# EasyEDA Pro project ProProject_STC8H小车18650版本_2024-07-14.epro

# Schematic Schematic6
Create Date: 2023-07-03; Page Name: P1; Project Name: STC8H小车18650版本; Schematic Name: Schematic6; Update Date: 2023-07-03; Company: 嘉立创EDA; Page Size: A3; Version: V1.0
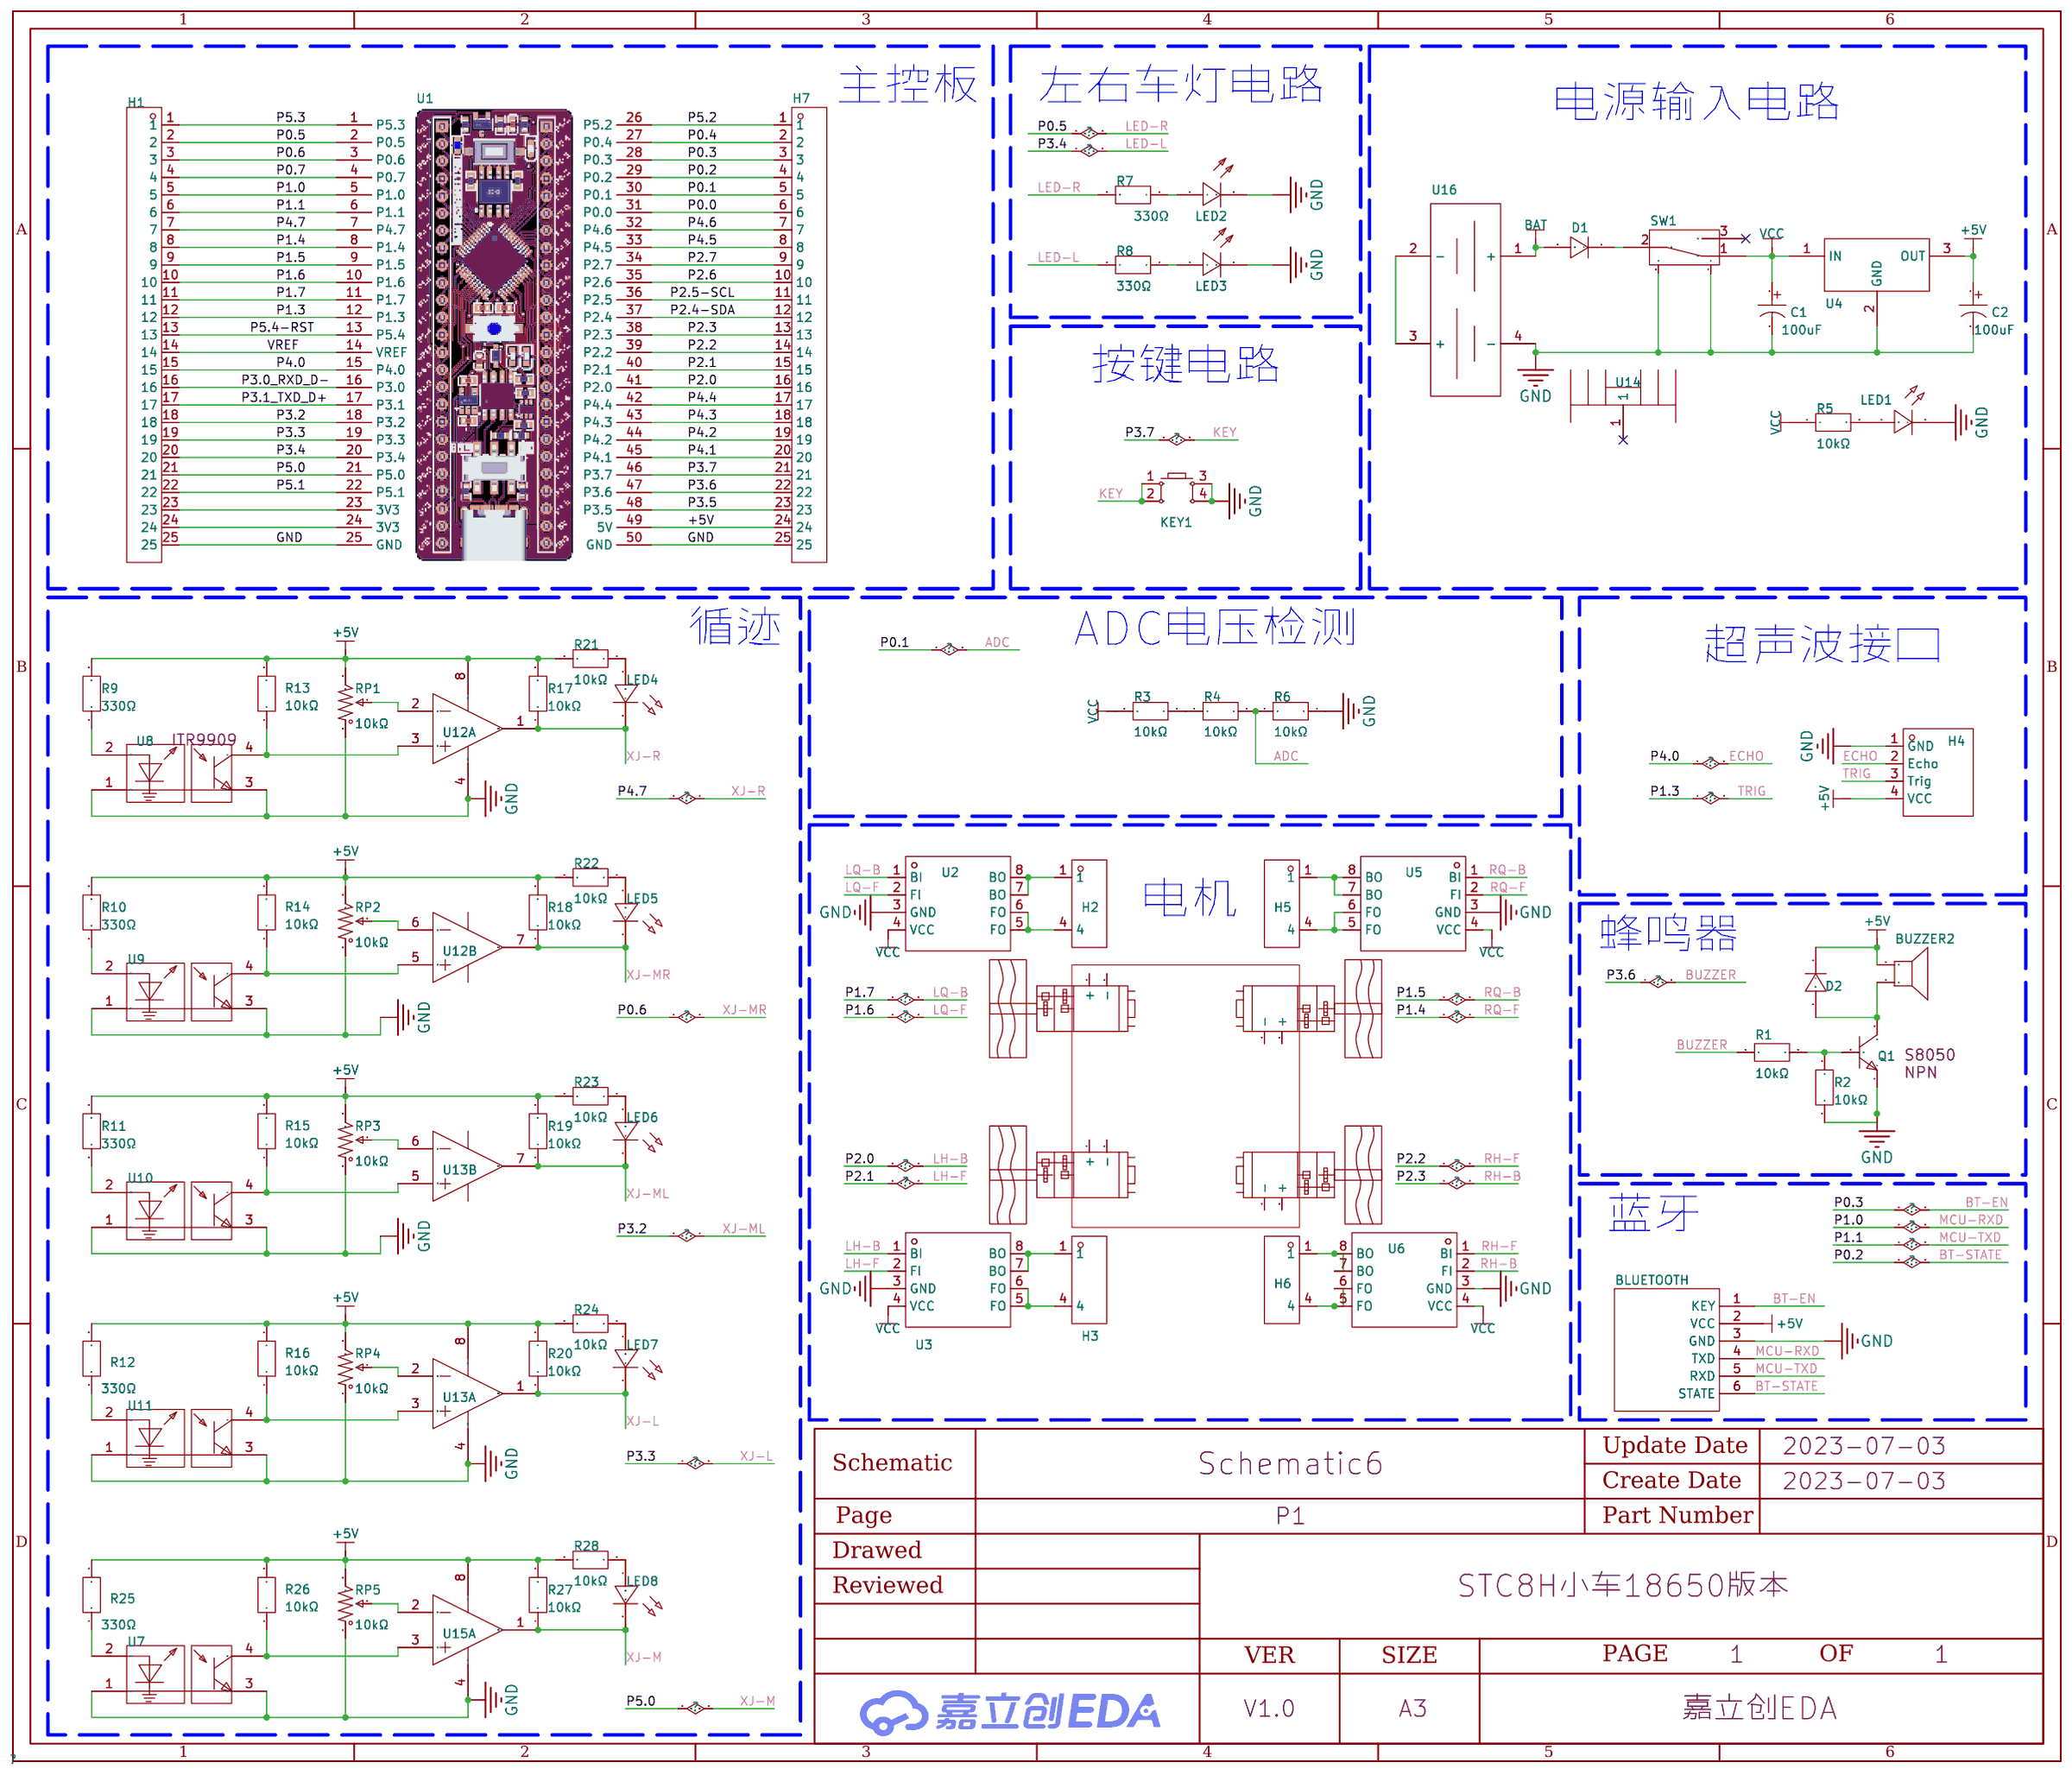
[diagram p0: schematic sheet]

## Parts
ASS_1  直流电机N20  [直流电机N20_水平装配]
ASS_1#2  直流电机N20  [直流电机N20_水平装配]
ASS_1#3  直流电机N20  [直流电机N20_水平装配]
ASS_1#4  直流电机N20  [直流电机N20_水平装配]
BLUETOOTH  JDY-31  [HC-05 PCB]
BUZZER2  4000Hz  [BUZ-TH_BD12.5-P6.50-D0.9]
C1  100uF  [CAP-TH_BD6.3-P2.50-D1.0-FD]
C2  100uF  [CAP-TH_BD6.3-P2.50-D1.0-FD]
D1  -  [DO-41_BD2.4-L4.7-P8.70-D0.9-RD]
D2  -  [DO-41_BD2.4-L4.7-P8.70-D0.9-RD]
H1  -  [HDR-TH_25P-P2.54-V-M]
H2  -  [HDR-TH_4P-P2.54-V-M]
H3  -  [HDR-TH_4P-P2.54-V-M]
H4  超声波测距模块_HC-HR04  [HC-HR04]
H5  -  [HDR-TH_4P-P2.54-V-M]
H6  -  [HDR-TH_4P-P2.54-V-M]
H7  -  [HDR-TH_25P-P2.54-V-M]
KEY1  -  [KEY-TH_4P-L6.0-W6.0-P3.90-LS6.5]
LED1  -  [LED-TH_BD3.0-P2.54-FD]
LED2  -  [LED-TH_BD5.8-P2.54-FD]
LED3  -  [LED-TH_BD5.8-P2.54-FD]
LED4  -  [LED-TH_BD3.0-P2.54-FD]
LED5  -  [LED-TH_BD3.0-P2.54-FD]
LED6  -  [LED-TH_BD3.0-P2.54-FD]
LED7  -  [LED-TH_BD3.0-P2.54-FD]
LED8  -  [LED-TH_BD3.0-P2.54-FD]
Q1  -  [TO-92-3_L5.1-W4.1-P1.27-L]
R1  10kΩ  [RES-TH_BD2.4-L6.3-P10.30-D0.6]
R2  10kΩ  [RES-TH_BD2.4-L6.3-P10.30-D0.6]
R3  10kΩ  [RES-TH_BD2.4-L6.3-P10.30-D0.6]
R4  10kΩ  [RES-TH_BD2.4-L6.3-P10.30-D0.6]
R5  10kΩ  [RES-TH_BD2.4-L6.3-P10.30-D0.6]
R6  10kΩ  [RES-TH_BD2.4-L6.3-P10.30-D0.6]
R7  330Ω  [RES-TH_BD2.3-L6.5-P10.50-D0.5]
R8  330Ω  [RES-TH_BD2.3-L6.5-P10.50-D0.5]
R9  330Ω  [RES-TH_BD2.3-L6.5-P10.50-D0.5]
R10  330Ω  [RES-TH_BD2.3-L6.5-P10.50-D0.5]
R11  330Ω  [RES-TH_BD2.3-L6.5-P10.50-D0.5]
R12  330Ω  [RES-TH_BD2.3-L6.5-P10.50-D0.5]
R13  10kΩ  [RES-TH_BD2.4-L6.3-P10.30-D0.6]
R14  10kΩ  [RES-TH_BD2.4-L6.3-P10.30-D0.6]
R15  10kΩ  [RES-TH_BD2.4-L6.3-P10.30-D0.6]
R16  10kΩ  [RES-TH_BD2.4-L6.3-P10.30-D0.6]
R17  10kΩ  [RES-TH_BD2.4-L6.3-P10.30-D0.6]
R18  10kΩ  [RES-TH_BD2.4-L6.3-P10.30-D0.6]
R19  10kΩ  [RES-TH_BD2.4-L6.3-P10.30-D0.6]
R20  10kΩ  [RES-TH_BD2.4-L6.3-P10.30-D0.6]
R21  10kΩ  [RES-TH_BD2.4-L6.3-P10.30-D0.6]
R22  10kΩ  [RES-TH_BD2.4-L6.3-P10.30-D0.6]
R23  10kΩ  [RES-TH_BD2.4-L6.3-P10.30-D0.6]
R24  10kΩ  [RES-TH_BD2.4-L6.3-P10.30-D0.6]
R25  330Ω  [RES-TH_BD2.3-L6.5-P10.50-D0.5]
R26  10kΩ  [RES-TH_BD2.4-L6.3-P10.30-D0.6]
R27  10kΩ  [RES-TH_BD2.4-L6.3-P10.30-D0.6]
R28  10kΩ  [RES-TH_BD2.4-L6.3-P10.30-D0.6]
RP1  10kΩ  [RES-ADJ-TH_3P-L10.0-W10.0-P2.50-L]
RP2  10kΩ  [RES-ADJ-TH_3P-L10.0-W10.0-P2.50-L]
RP3  10kΩ  [RES-ADJ-TH_3P-L10.0-W10.0-P2.50-L]
RP4  10kΩ  [RES-ADJ-TH_3P-L10.0-W10.0-P2.50-L]
RP5  10kΩ  [RES-ADJ-TH_3P-L10.0-W10.0-P2.50-L]
SW1  -  [SW-TH_SK-12E12-G5]
U1  -  [STC8H8K64U_CORE]
U2  -  [SOP-8_L4.9-W3.9-P1.27-LS6.0-BL]
U3  -  [SOP-8_L4.9-W3.9-P1.27-LS6.0-BL]
U4  -  [TO-220-3_L10.0-W4.5-P2.54-L]
U5  -  [SOP-8_L4.9-W3.9-P1.27-LS6.0-BL]
U6  -  [SOP-8_L4.9-W3.9-P1.27-LS6.0-BL]
U7  -  [OPTO-TH_ITR9909]
U8  -  [OPTO-TH_ITR9909]
U9  -  [OPTO-TH_ITR9909]
U10  -  [OPTO-TH_ITR9909]
U11  -  [OPTO-TH_ITR9909]
U12  -  [DIP-8_L9.7-W6.4-P2.54-LS7.6-BL]  (sections 1,2)
U13  -  [DIP-8_L9.7-W6.4-P2.54-LS7.6-BL]  (sections 1,2)
U14  -  [HEATSINK-TH_L15.5-W10.5-XSD1226-005]
U15  -  [DIP-8_L9.7-W6.4-P2.54-LS7.6-BL]  (section 1)
U16  -  [18650电池盒两节串联]

## Library data of the parts
ASS_1 ASS_1#2-ASS_1#4 = 直流电机N20: Pin Type: IN
BLUETOOTH = HC-05: Pin Type: IN
BUZZER2 = SFN-12055PA6.5: 驱动方式:无源(外部驱动);构造类型:压电式;额定电压:5V;频率:4000Hz;声压(SPL):80dB@5V,10cm;直径(φD):12.5mm;高度:6mm;; LCSC Part Name: 压电无源蜂鸣器; Supplier Part: C360607; Manufacturer: S&S(海旭); Supplier Footprint: 插件,P=6.5mm; JLCPCB Part Class: 扩展库; Datasheet: https://atta.szlcsc.com/upload/public/pdf/source/20220225/D801AF3A55A67CFB490E002F7E7725D1.pdf; Supplier: LCSC; Oscillator Circuit: 无源(外部驱动); Technology Type: 压电式; Rated Voltage: 5V; Sound Pressure Level (SPL): 80dB@5V,10cm; Diameter (φD): 12.5mm; Height: 6mm
C1 C2 = KM107M035E11RR0VH2FP0: 脚间距:2.5mm;纹波电流:168mA 120Hz;容值:100uF;额定电压:35V;等效串联电阻:-;精度:±20%;工作温度:-;电容体长度:11mm;电容体直径:6.3mm;工作寿命:1000hrs 105;; LCSC Part Name: 100uF35V; Supplier Part: C19504; Manufacturer: CX(承兴); Supplier Footprint: 径向引线,6.3x11mm; JLCPCB Part Class: 扩展库; Datasheet: https://atta.szlcsc.com/upload/public/pdf/source/20151029/1457707510876.pdf; Supplier: LCSC; Lead Spacing: 2.5mm; Ripple Current: 168mA120Hz; Rated Voltage: 35V; Tolerance: ±20%; L: 11mm; φD: 6.3mm; Lifetime @ Temp: 1000hrs 105
D1 D2 = 1N4007_C402311: LCSC Part Name: 1N4007; Supplier Part: C402311; Manufacturer: LGE(鲁光); Manufacturer Part: 1N4007; Supplier Footprint: DO-41; Datasheet: https://atta.szlcsc.com/upload/public/pdf/source/20190705/C402311_D2D67FF606A14042155DA6DAFA20C736.pdf; Supplier: LCSC
H1 H7 = X6511WV-25H-C30D60: 间距:2.54mm;总PIN位数:25;排数:1;插针结构:1x25P;行距:-;安装类型:直插;圆针/方针:方针;额定电流:3A;额定电压:250V;配合针长度:6mm;塑高:2.5mm;端接针长度:3mm;触头材质:黄铜;触头镀层:金;工作温度范围:-40℃~+105℃;焊接温度(最大值):260℃;颜色:黑色;; LCSC Part Name: 2.54mm1x25P直插方针高镀金抗氧化; Supplier Part: C725957; Manufacturer: XKBConnectivity(中国星坤); Supplier Footprint: 直插,P=2.54mm; JLCPCB Part Class: 扩展库; Datasheet: https://atta.szlcsc.com/upload/public/pdf/source/20211009/D19569EFFEB9776B42364DF7D41FD96A.pdf; Supplier: LCSC; Pitch: 2.54mm; Number of Pins: 25; Number of Rows: 1; Pin Structure: 1x25P; Mounting Type: 直插; Circluar Pins/Square Pins: 方针; Current Rating (Max): 3A; Voltage Rating (Max): 250V; Length of Mating Pin: 6mm; Insulation Height: 2.5mm; Length of End Connection Pin: 3mm; Contact Material: 黄铜; Contact Plating: 金; Operating Temperature Range: -40℃~+105℃; Welding Temperature (Max): 260℃; Color: 黑色
H2 H3 H5 H6 = HDR-M_2.54_1x4P: Supplier Part: C492403; Supplier Footprint: 插件; NO_CONNECT: yes
H4 = 超声波测距模块_HC-HR04: Pin Type: IN
KEY1 = Key_TH_6x6x4.5: 电路结构:单刀单掷;安装方式:直插;按钮形状:圆形按钮;按钮/盖帽颜色:黑色;作用力:250gf@±30gf;引脚样式:PC引脚;开关长度:6mm;开关宽度:6mm;开关高度:4.5mm;带支架:否;; Supplier Part: C2834896; Supplier Footprint: 插件
LED1 = LED_TH-R_3mm: Supplier Footprint: 插件; Supplier: 立创商城; Supplier Part: C99771
LED2 LED3 = TJ-L5FCMYGTDLSFLC6TW-A5: 发光颜色:白灯;; LCSC Part Name: 白灯; Supplier Part: C331025; Manufacturer: TOGIALED(台湾统佳); Supplier Footprint: 插件,D=5mm; JLCPCB Part Class: 扩展库; Datasheet: https://atta.szlcsc.com/upload/public/pdf/source/20190107/C331025_3C86FA64154A6CCDAF3EF0231B5ACE43.pdf; Supplier: LCSC; Emitted Color: 白灯
LED4-LED6 = LED_TH-G_3mm: Supplier Footprint: 插件; Supplier Part: C330929; Supplier: 立创商城
LED7 LED8 = LED_TH-G_3mm: Supplier Footprint: 插件; Supplier: 立创商城; Supplier Part: C330929
Q1 = S8050: 晶体管类型:NPN;集射极击穿电压(Vceo):25V;集电极电流(Ic):500mA;功率(Pd):625mW;集电极-发射极饱和电压(VCE(sat)@Ic,Ib):600mV@500mA,50mA;直流电流增益(hFE@Ic,Vce):85@50A,1V;特征频率(fT):150MHz;工作温度:+150@(Tj);; LCSC Part Name: S8050TO-92TO-92; Supplier Part: C2826359; Manufacturer: Slkor(萨科微); Supplier Footprint: TO-92; JLCPCB Part Class: 扩展库; Datasheet: https://atta.szlcsc.com/upload/public/pdf/source/20210420/C2826359_B8820C49D6B6820579F5C2002741ABDD.pdf; Supplier: LCSC; Transistor Type: NPN; Collector-Emitter Breakdown Voltage (Vceo): 25V; Collector Current (Ic): 500mA; Power Dissipation (Pd): 625mW; Collector-Emitter Saturation Voltage (VCE(sat)@Ic,Ib): 600mV@500mA,50mA; DC Current Gain (hFE@Ic,Vce): 85@50A,1V; Transition Frequency (fT): 150MHz; Operating Temperature: +150@(Tj)
R1-R6 R13-R24 R26-R28 = RN 1/4W 10K F T/B A1: 电阻类型:金属膜电阻;阻值:10kΩ;精度:±1%;功率:250mW;温度系数:±50ppm/;最大工作电压:250V;工作温度范围:-55~+125;; LCSC Part Name: 10kΩ±1%250mW; Supplier Part: C410695; Manufacturer: Tyohm(幸亚电阻); Manufacturer Part: RN1/4W10KFT/BA1; Supplier Footprint: 轴向引线; JLCPCB Part Class: 扩展库; Datasheet: https://atta.szlcsc.com/upload/public/pdf/source/20190808/C410695_F4C96186075092C4BC649A77CE7E5B2A.pdf; Supplier: LCSC; Type: 金属膜电阻; Tolerance: ±1%; Power(Watts): 250mW; Temperature Coefficient: ±50ppm/; Overload Voltage (Max): 250V; Operating Temperature Range: -55~+125
R7-R12 R25 = MF1/4W-330Ω±1%T52: 温度系数:±200ppm/;工作温度范围:-;阻值:330Ω;功率:250mW;类型:金属膜电阻;精度:±1%;; LCSC Part Name: 330Ω(3300)±1%; Supplier Part: C713986; Manufacturer: 华星机电; Supplier Footprint: 轴向引线; JLCPCB Part Class: 扩展库; Datasheet: https://atta.szlcsc.com/upload/public/pdf/source/20200731/C713882_AE8EB1102749D7E4FB4FB13DC898C429.pdf; Supplier: LCSC; Temperature Coefficient: ±200ppm/; Power(Watts): 250mW; Type: 金属膜电阻; Tolerance: ±1%
RP1-RP5 = 3296W-1-103: 阻值:10kΩ;精度:±10%;温度系数:±250ppm/;; LCSC Part Name: 10kΩ±10%; Supplier Part: C118954; Manufacturer: BOCHEN(博晨); Supplier Footprint: 插件; JLCPCB Part Class: 扩展库; Datasheet: https://atta.szlcsc.com/upload/public/pdf/source/20171114/C118954_15106326646611117443.pdf; Supplier: LCSC; Tolerance: ±10%; Temperature Coefficient: ±250ppm/
SW1 = SK-12E12-G5: 额定电流(DC):-;额定电压(DC):-;额定电流(AC):-;额定电压(AC):-;电路结构:单刀双掷;安装方式:卧插;机械寿命:5000;滑钮形状:矩形柱状;引脚样式:PC引脚;工作温度:-25~+70;开关高度:10.6mm;; Supplier Part: C136720; Manufacturer: 韩国韩荣; Supplier Footprint: 插件; JLCPCB Part Class: 扩展库; Datasheet: https://atta.szlcsc.com/upload/public/pdf/source/20210810/880D64C2F8CCE477762EFCC00B7B7681.pdf; Supplier: LCSC; Circuit: 单刀双掷; Mounting Style: 卧插; Mechanical Life: 5000; Actuator Style: 矩形柱状; Pin Style: PC引脚; Operating Temperature: -25~+70; Switch Height: 10.6mm
U1 = STC8H8K64U_CORE
U2 U3 U5 U6 = rz7899: 25V 4A 控制直流电机正反转; Supplier Part: C92373; Manufacturer: RZ睿智微; Supplier Footprint: SOP-8_150mil; JLCPCB Part Class: 扩展库; Datasheet: https://atta.szlcsc.com/upload/public/pdf/source/20170213/1486965283321.pdf; Supplier: LCSC
U4 = L7805CV: 输出类型:固定;输出极性:正;输出通道数:1;最大输入电压:35V;输出电压:5V;压差:2V@(1A);输出电流:1.5A;电源纹波抑制比(PRSS):62dB@(120Hz);; LCSC Part Name: Vin=35VVout=5V1.5A62dB@(120Hz)散热片厚度0.6mm; Supplier Part: C111887; Manufacturer: ST(意法半导体); Supplier Footprint: TO-220(TO-220-3); JLCPCB Part Class: 扩展库; Datasheet: https://atta.szlcsc.com/upload/public/pdf/source/20170511/1494500122263.pdf; Supplier: LCSC; Output Type: 固定; Output Polarity: 正; Number of Outputs: 1; Maximum Input Voltage: 35V; Output Voltage: 5V; Dropout Voltage: 2V@(1A); Output Current: 1.5A; Power Supply Rejection Ratio (PRSS): 62dB@(120Hz)
U7-U11 = ITR9909: Supplier Part: C53399; Manufacturer: EVERLIGHT(台湾亿光); Supplier Footprint: DIP-4; JLCPCB Part Class: 扩展库; Datasheet: https://atta.szlcsc.com/upload/public/pdf/source/20201022/C53399_E5C79523D84B21DC4419F8E709CCCF2E.pdf; Supplier: LCSC
U12 U13 U15 = XD393: 比较器组数:-;电源电压:-;各通道供电电流:-;输出类型:-;传播延迟:-;; LCSC Part Name: 模拟比较器; Supplier Part: C561266; Manufacturer: XINLUDA(信路达); Supplier Footprint: DIP-8; JLCPCB Part Class: 扩展库; Datasheet: https://atta.szlcsc.com/upload/public/pdf/source/20220616/E76F986B22492B94D9FEFF1B0F4D78D5.pdf; Supplier: LCSC
U14 = 散热片15.5*10.5*24 带针: LCSC Part Name: 散热片15.5*10.5*24带针H型; Supplier Part: C108928; Manufacturer: XSD(鑫顺达); Manufacturer Part: 散热片15.5*10.5*24带针; Supplier Footprint: 15*10.5*24; JLCPCB Part Class: 扩展库; Datasheet: https://atta.szlcsc.com/upload/public/pdf/source/20180614/C108928_606EC6D8E4D943F4065E73A7656775A1.pdf; Supplier: LCSC
U16 = 18650电池盒两节串联

## Nets
+5V: BLUETOOTH.2(VCC) BUZZER2.1 C2.1 D2.1 H4.4(VCC) H7.24 R9.2 R10.2 R11.2 R12.2 R13.2 R14.2 R15.2 R16.2 R17.2 R18.2 R19.2 R20.2 R21.2 R22.2 R23.2 R24.2 R25.2 R26.2 R27.2 R28.2 RP1.3 RP2.3 RP3.3 RP4.3 RP5.3 U1.49(5V) U4.3(OUT) U12.8(VCC) U13.8(VCC) U15.8(VCC)
GND: BLUETOOTH.3(GND) C1.2 C2.2 H1.25 H4.1(GND) H7.25 KEY1.3 KEY1.4 LED1.2(A) LED2.2 LED3.2 Q1.1(E) R2.1 R6.1 RP1.1 RP2.1 RP3.1 RP4.1 RP5.1 SW1.4 SW1.5 U1.25(GND) U1.50(GND) U2.3(GND) U3.3(GND) U4.2(GND) U5.3(GND) U6.3(GND) U7.1 U7.3 U8.1 U8.3 U9.1 U9.3 U10.1 U10.3 U11.1 U11.3 U12.4(GND) U13.4(GND) U15.4(GND) U16.4(-)
VCC: C1.1 R3.2 R5.1 SW1.1 U2.4(VCC) U3.4(VCC) U4.1(IN) U5.4(VCC) U6.4(VCC)
ADC: H7.5 R4.1 R6.2 U1.30(P0.1)
BAT: D1.2 U16.1(+)
BT-EN: BLUETOOTH.1(KEY) H7.3 U1.28(P0.3)
BT-STATE: BLUETOOTH.6(STATE) H7.4 U1.29(P0.2)
BUZZER: H7.22 R1.1 U1.47(P3.6)
ECHO: H1.15 H4.2(Echo) U1.15(P4.0)
KEY: H7.21 KEY1.1 KEY1.2 U1.46(P3.7)
LED-L: H1.20 R8.2 U1.20(P3.4)
LED-R: H1.2 R7.2 U1.2(P0.5)
LH-B: H7.16 U1.41(P2.0) U3.1(BI)
LH-F: H7.15 U1.40(P2.1) U3.2(FI)
LQ-B: H1.11 U1.11(P1.7) U2.1(BI)
LQ-F: H1.10 U1.10(P1.6) U2.2(FI)
MCU-RXD: BLUETOOTH.4(TXD) H1.5 U1.5(P1.0)
MCU-TXD: BLUETOOTH.5(RXD) H1.6 U1.6(P1.1)
P0.0: H7.6 U1.31(P0.0)
P0.4: H7.2 U1.27(P0.4)
P0.6: H1.3 LED5.2(A) R18.1 U1.3(P0.6) U12.7(OUT2)
P0.7: H1.4 U1.4(P0.7)
P1.3: H1.12 H4.3(Trig) U1.12(P1.3)
P1.4: H1.8 U1.8(P1.4) U5.2(FI)
P1.5: H1.9 U1.9(P1.5) U5.1(BI)
P2.2: H7.14 U1.39(P2.2) U6.1(BI)
P2.3: H7.13 U1.38(P2.3) U6.2(FI)
P2.4-SDA: H7.12 U1.37(P2.4)
P2.5-SCL: H7.11 U1.36(P2.5)
P2.6: H7.10 U1.35(P2.6)
P2.7: H7.9 U1.34(P2.7)
P3.0_RXD_D-: H1.16 U1.16(P3.0)
P3.1_TXD_D+: H1.17 U1.17(P3.1)
P3.2: H1.18 LED6.2(A) R19.1 U1.18(P3.2) U13.7(OUT2)
P3.3: H1.19 LED7.2(A) R20.1 U1.19(P3.3) U13.1(OUT1)
P3.5: H7.23 U1.48(P3.5)
P4.1: H7.20 U1.45(P4.1)
P4.2: H7.19 U1.44(P4.2)
P4.3: H7.18 U1.43(P4.3)
P4.4: H7.17 U1.42(P4.4)
P4.5: H7.8 U1.33(P4.5)
P4.6: H7.7 U1.32(P4.6)
P4.7: H1.7 LED4.2(A) R17.1 U1.7(P4.7) U12.1(OUT1)
P5.0: H1.21 LED8.2(A) R27.1 U1.21(P5.0) U15.1(OUT1)
P5.1: H1.22 U1.22(P5.1)
P5.2: H7.1 U1.26(P5.2)
P5.3: H1.1 U1.1(P5.3)
P5.4-RST: H1.13 U1.13(P5.4)
VREF: H1.14 U1.14(VREF)
$1N5269: D1.1 SW1.2
$1N5272: LED2.1 R7.1
$1N5275: LED3.1 R8.1
$1N5280: RP4.2 U13.2(IN1-)
$1N5281: RP3.2 U13.6(IN2-)
$1N5282: R11.1 U10.2
$1N5283: R9.1 U8.2
$1N5309: R3.1 R4.2
$1N5335: H1.23 U1.23(3V3)
$1N5336: H1.24 U1.24(3V3)
$1N5409: LED4.1(C) R21.1
$1N5410: RP1.2 U12.2(IN1-)
$1N5411: R13.1 U8.4 U12.3(IN1+)
$1N5412: R10.1 U9.2
$1N5413: RP2.2 U12.6(IN2-)
$1N5420: LED6.1(C) R23.1
$1N5422: R14.1 U9.4 U12.5(IN2+)
$1N5423: R15.1 U10.4 U13.5(IN2+)
$1N5424: R12.1 U11.2
$1N5425: R16.1 U11.4 U13.3(IN1+)
$1N5426: LED7.1(C) R24.1
$1N5435: H3.1 U3.7(BO) U3.8(BO)
$1N5436: H3.4 U3.5(FO) U3.6(FO)
$1N5437: H2.1 U2.7(BO) U2.8(BO)
$1N5438: H2.4 U2.5(FO) U2.6(FO)
$1N5440: H5.1 U5.7(BO) U5.8(BO)
$1N5441: H5.4 U5.5(FO) U5.6(FO)
$1N5443: BUZZER2.2 D2.2 Q1.3(C)
$1N5444: Q1.2(B) R1.2 R2.2
$1N5446: H6.1 U6.7(BO) U6.8(BO)
$1N5447: H6.4 U6.5(FO) U6.6(FO)
$1N5452: LED1.1(C) R5.2
$1N12611: U16.2(-) U16.3(+)
$1N13005: RP5.2 U15.2(IN1-)
$1N13006: R25.1 U7.2
$1N13007: R26.1 U7.4 U15.3(IN1+)
$1N13008: LED8.1(C) R28.1
$1N15984: LED5.1(C) R22.1

Not connected (* = marked no-connect by the designer): ASS_1 1(+) 2(-); ASS_1#2 1(+) 2(-); ASS_1#3 1(+) 2(-); ASS_1#4 1(+) 2(-); SW1 3*; U14 1*

## Notes on the sheet
- 主控板
- 左右车灯电路
- 电源输入电路
- 按键电路
- 循迹
- ADC电压检测
- 超声波接口
- 电机
- 蜂鸣器
- 蓝牙

# Board PCB11
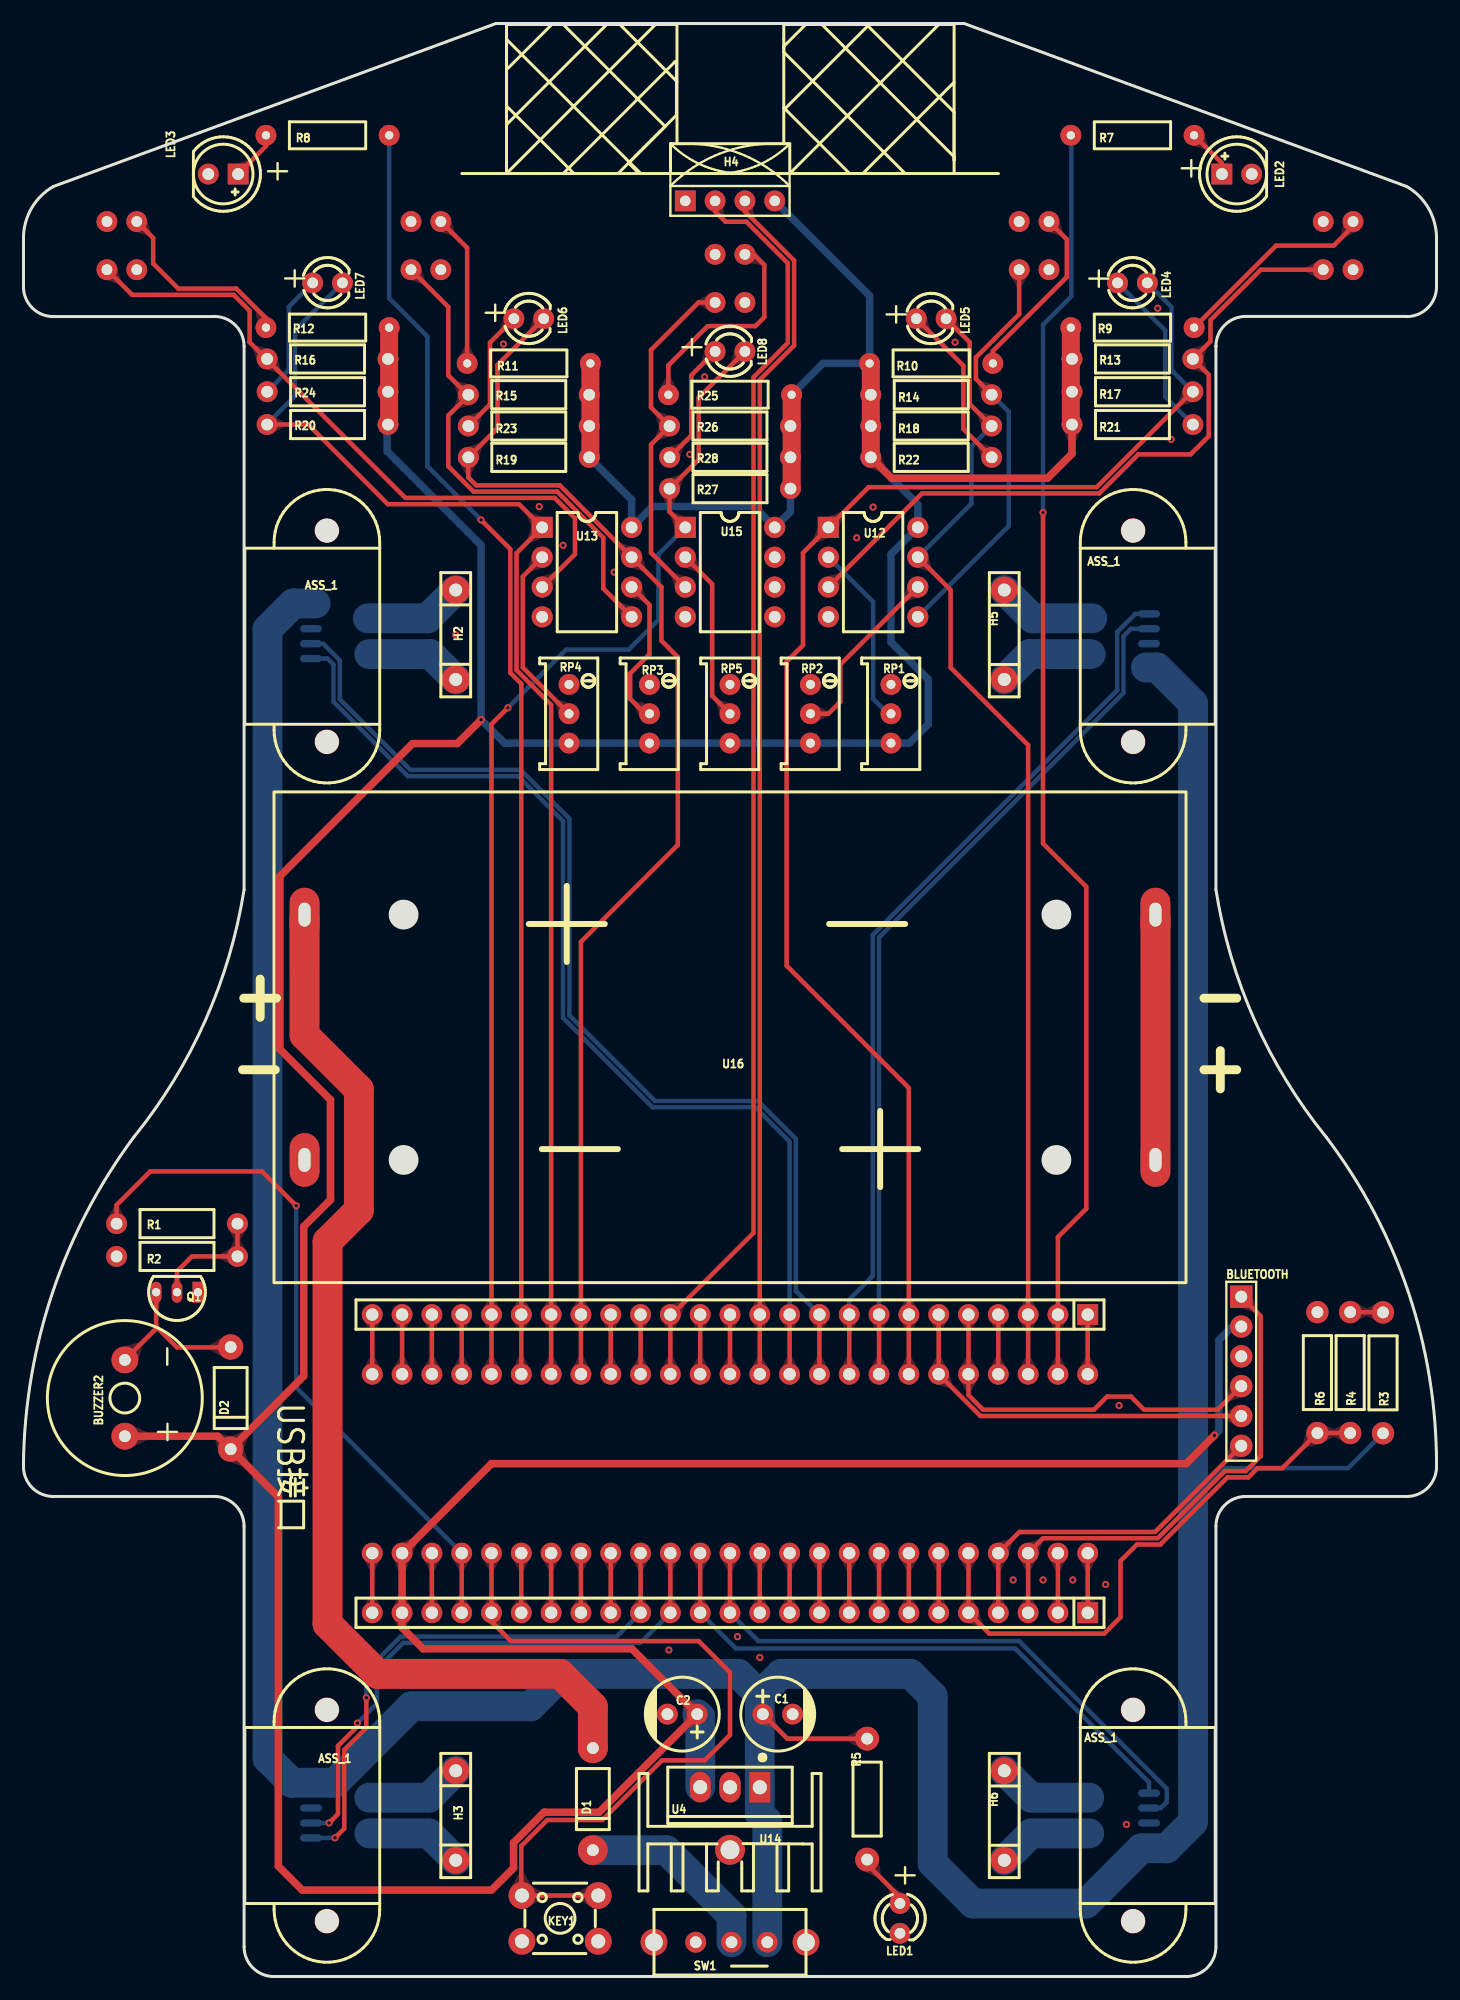
[diagram p1: board, top side]
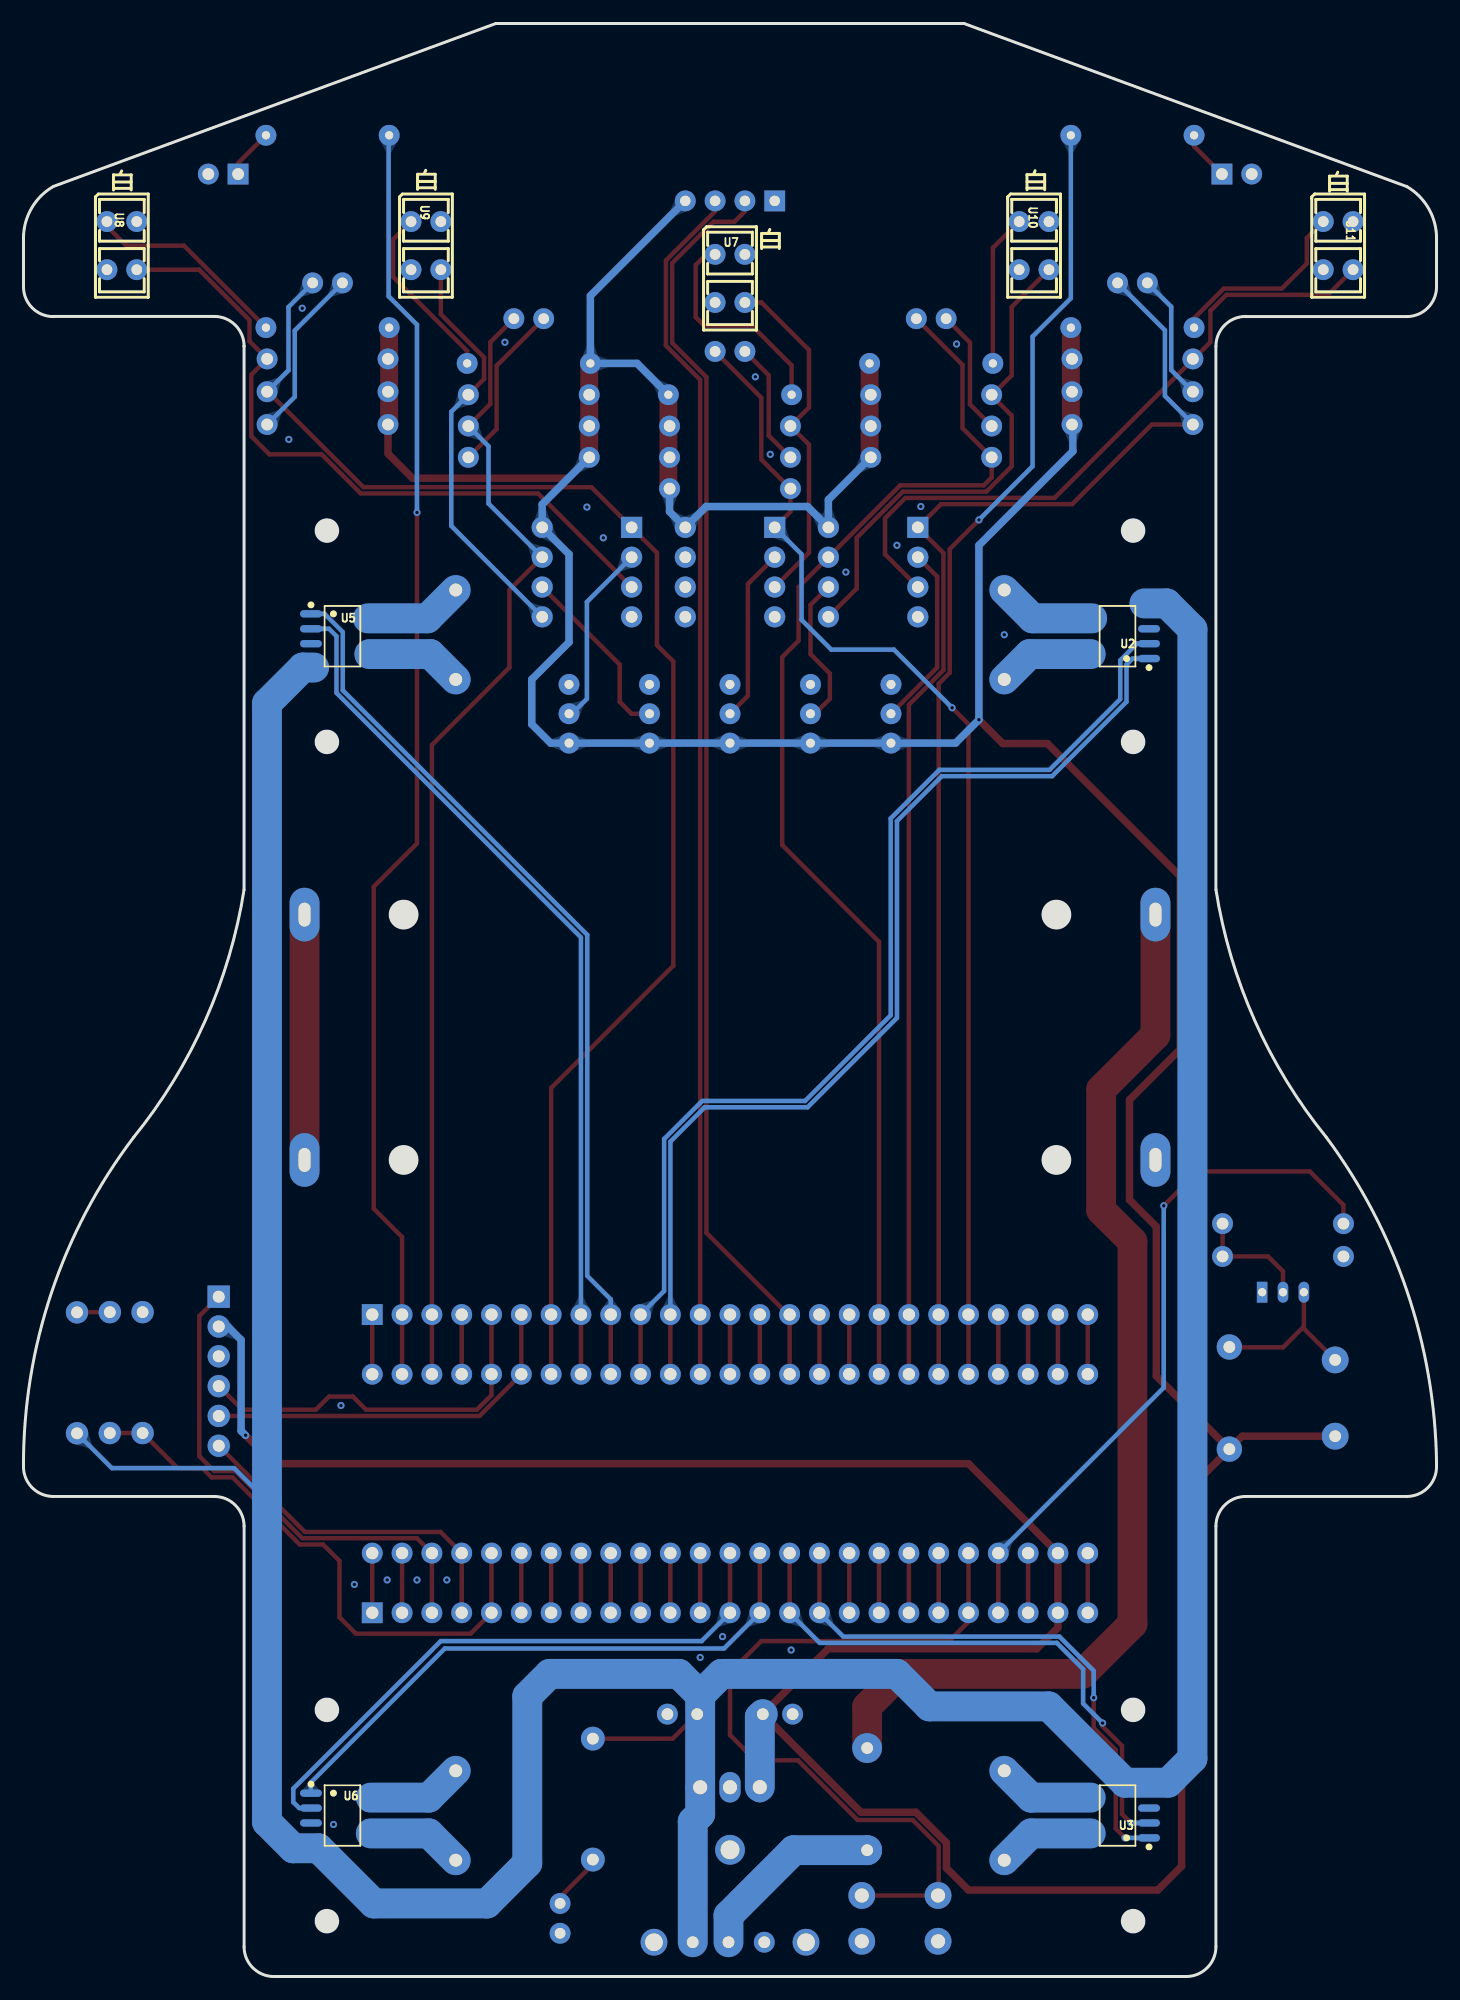
[diagram p2: board, bottom side, seen from below]

Outline 120.4 x 166.37 mm; copper layers: Top Layer, Bottom Layer. Coordinates in mm from the lower left corner of the outline.
Outline path: 0,148.08 0,143.94 arc(0.74,142.15) 2.54,141.4 16.24,141.4 arc(16.25,141.41) 16.26,141.41 arc(18.05,140.67) 18.8,138.87 18.8,92.58 arc(15.48,81.42) 9.4,71.5 arc(2.52,58.4) 0,43.82 0,43.43 arc(0.74,41.64) 2.54,40.89 16.26,40.89 arc(18.05,40.15) 18.8,38.35 18.8,2.54 arc(19.54,0.74) 21.34,0 99.06,0 arc(100.86,0.74) 101.6,2.54 101.6,38.35 arc(102.34,40.15) 104.14,40.89 117.86,40.89 arc(119.65,41.64) 120.4,43.43 arc(118.01,58.24) 111,71.5 arc(104.91,81.42) 101.6,92.58 101.6,138.87 arc(101.6,138.87) 101.6,138.87 arc(102.34,140.67) 104.14,141.41 117.84,141.41 arc(117.85,141.41) 117.86,141.4 arc(119.65,142.15) 120.4,143.94 120.4,148.08 arc(119.72,150.62) 117.86,152.48 80.14,166.37 40.26,166.37 2.54,152.48 arc(0.68,150.62) 0,148.08
Stack: Top Layer 0.035mm / Dielectric1 1.51mm FR4 er 4.5 / Bottom Layer 0.035mm

## Design rules (mm)
template: 用户自定义配置
spacing safeClearance (default): track to track 0.152, other pairs 0.152 to 0.3
track width trackWidth (default): min 0.127, default 0.254, max 2.54
differential pair differentialPair (default): width min 0.127, default 0.254, max 2.54; gap min 0.152, default 0.152
via viaSize (default): diameter min 0.5, default 0.61, max 10; hole min 0.3, default 0.305, max 6

## Placement (name value [footprint] x y rotation side)
ASS_1  直流电机N20  [直流电机N20_水平装配]  30.35 114.17 90 top
ASS_1#2  直流电机N20  [直流电机N20_水平装配]  30.35 13.72 90 top
ASS_1#3  直流电机N20  [直流电机N20_水平装配]  90.04 114.17 270 top
ASS_1#4  直流电机N20  [直流电机N20_水平装配]  90.04 13.72 270 top
BLUETOOTH  JDY-31  [hc-05 pcb]  103.76 57.91 0 top
BUZZER2  4000Hz  [buz-th_bd12.5-p6.50-d0.9]  8.64 49.28 90 top
C1  100uF  [cap-th_bd6.3-p2.50-d1.0-fd]  64.26 22.35 0 top
C2  100uF  [cap-th_bd6.3-p2.50-d1.0-fd]  56.13 22.35 180 top
D1  -  [do-41_bd2.4-l4.7-p8.70-d0.9-rd]  48.51 15.11 90 top
D2  -  [do-41_bd2.4-l4.7-p8.70-d0.9-rd#2]  17.65 49.28 90 top
H1  -  [hdr-th_25p-p2.54-v-m]  60.2 56.39 180 top
H2  -  [hdr-th_4p-p2.54-v-m#2]  36.83 114.3 90 top
H3  -  [hdr-th_4p-p2.54-v-m]  36.83 13.72 90 top
H4  超声波测距模块_HC-HR04  [hc-hr04]  60.2 151.26 0 top
H5  -  [hdr-th_4p-p2.54-v-m]  83.57 114.3 270 top
H6  -  [hdr-th_4p-p2.54-v-m]  83.57 13.72 270 top
H7  -  [hdr-th_25p-p2.54-v-m]  60.2 30.99 180 top
KEY1  -  [key-th_4p-l6.0-w6.0-p3.90-ls6.5]  45.72 4.95 0 top
LED1  -  [led-th_bd3.0-p2.54-fd]  74.68 4.95 270 top
LED2  -  [led-th_bd5.8-p2.54-fd]  103.38 153.54 0 top
LED3  -  [led-th_bd5.8-p2.54-fd]  17.02 153.54 180 top
LED4  -  [led-th_bd3.0-p2.54-fd]  94.49 144.27 0 top
LED5  -  [led-th_bd3.0-p2.54-fd]  77.34 141.22 0 top
LED6  -  [led-th_bd3.0-p2.54-fd]  43.05 141.22 0 top
LED7  -  [led-th_bd3.0-p2.54-fd]  25.91 144.27 0 top
LED8  -  [led-th_bd3.0-p2.54-fd]  60.2 138.43 0 top
Q1  -  [to-92-3_l5.1-w4.1-p1.27-l]  13.08 58.29 180 top
R1  10kΩ  [res-th_bd2.4-l6.3-p10.30-d0.6]  13.08 64.13 0 top
R2  10kΩ  [res-th_bd2.4-l6.3-p10.30-d0.6]  13.08 61.34 0 top
R3  10kΩ  [res-th_bd2.4-l6.3-p10.30-d0.6#2]  115.83 51.42 270 top
R4  10kΩ  [res-th_bd2.4-l6.3-p10.30-d0.6#2]  113.04 51.44 90 top
R5  10kΩ  [res-th_bd2.4-l6.3-p10.30-d0.6#3]  71.88 15.11 270 top
R6  10kΩ  [res-th_bd2.4-l6.3-p10.30-d0.6#2]  110.25 51.44 270 top
R7  330Ω  [res-th_bd2.3-l6.5-p10.50-d0.5]  94.49 156.84 180 top
R8  330Ω  [res-th_bd2.3-l6.5-p10.50-d0.5]  25.91 156.84 0 top
R9  330Ω  [res-th_bd2.3-l6.5-p10.50-d0.5]  94.49 140.46 180 top
R10  330Ω  [res-th_bd2.3-l6.5-p10.50-d0.5]  77.34 137.41 180 top
R11  330Ω  [res-th_bd2.3-l6.5-p10.50-d0.5]  43.05 137.41 0 top
R12  330Ω  [res-th_bd2.3-l6.5-p10.50-d0.5]  25.91 140.46 0 top
R13  10kΩ  [res-th_bd2.4-l6.3-p10.30-d0.6]  94.49 137.79 180 top
R14  10kΩ  [res-th_bd2.4-l6.3-p10.30-d0.6]  77.34 134.75 180 top
R15  10kΩ  [res-th_bd2.4-l6.3-p10.30-d0.6]  43.05 134.75 0 top
R16  10kΩ  [res-th_bd2.4-l6.3-p10.30-d0.6]  25.91 137.79 0 top
R17  10kΩ  [res-th_bd2.4-l6.3-p10.30-d0.6]  94.49 135 180 top
R18  10kΩ  [res-th_bd2.4-l6.3-p10.30-d0.6]  77.34 132.08 180 top
R19  10kΩ  [res-th_bd2.4-l6.3-p10.30-d0.6]  43.05 129.41 0 top
R20  10kΩ  [res-th_bd2.4-l6.3-p10.30-d0.6]  25.91 132.21 0 top
R21  10kΩ  [res-th_bd2.4-l6.3-p10.30-d0.6]  94.49 132.21 180 top
R22  10kΩ  [res-th_bd2.4-l6.3-p10.30-d0.6]  77.34 129.41 180 top
R23  10kΩ  [res-th_bd2.4-l6.3-p10.30-d0.6]  43.05 132.08 0 top
R24  10kΩ  [res-th_bd2.4-l6.3-p10.30-d0.6]  25.91 135 0 top
R25  330Ω  [res-th_bd2.3-l6.5-p10.50-d0.5]  60.2 134.75 0 top
R26  10kΩ  [res-th_bd2.4-l6.3-p10.30-d0.6]  60.2 132.08 0 top
R27  10kΩ  [res-th_bd2.4-l6.3-p10.30-d0.6]  60.2 126.75 0 top
R28  10kΩ  [res-th_bd2.4-l6.3-p10.30-d0.6]  60.2 129.41 0 top
RP1  10kΩ  [res-adj-th_3p-l10.0-w10.0-p2.50-l]  73.91 107.57 270 top
RP2  10kΩ  [res-adj-th_3p-l10.0-w10.0-p2.50-l]  67.06 107.57 270 top
RP3  10kΩ  [res-adj-th_3p-l10.0-w10.0-p2.50-l]  53.34 107.57 270 top
RP4  10kΩ  [res-adj-th_3p-l10.0-w10.0-p2.50-l]  46.48 107.57 270 top
RP5  10kΩ  [res-adj-th_3p-l10.0-w10.0-p2.50-l]  60.2 107.57 270 top
SW1  -  [sw-th_sk-12e12-g5]  60.2 2.92 270 top
U1  -  [stc8h8k64u_core]  60.2 43.69 270 top
U2  -  [SOP-8_L4.9-W3.9-P1.27-LS6.0-BL]  27.18 114.17 90 bottom
U3  -  [SOP-8_L4.9-W3.9-P1.27-LS6.0-BL]  27.18 13.72 90 bottom
U4  -  [TO-220-3_L10.0-W4.5-P2.54-L]  60.2 16.13 180 top
U5  -  [SOP-8_L4.9-W3.9-P1.27-LS6.0-BL]  93.22 114.17 270 bottom
U6  -  [SOP-8_L4.9-W3.9-P1.27-LS6.0-BL]  93.22 13.72 270 bottom
U7  -  [opto-th_itr9909]  60.2 144.65 270 bottom
U8  -  [opto-th_itr9909]  112.01 147.45 270 bottom
U9  -  [opto-th_itr9909]  86.11 147.45 270 bottom
U10  -  [opto-th_itr9909]  34.29 147.45 270 bottom
U11  -  [opto-th_itr9909]  8.38 147.45 270 bottom
U12  -  [DIP-8_L9.7-W6.4-P2.54-LS7.6-BL]  72.39 119.63 270 top
U13  -  [DIP-8_L9.7-W6.4-P2.54-LS7.6-BL]  48.01 119.63 270 top
U14  -  [heatsink-th_l15.5-w10.5-xsd1226-005]  60.2 10.79 180 top
U15  -  [DIP-8_L9.7-W6.4-P2.54-LS7.6-BL]  60.2 119.63 270 top
U16  -  [18650电池盒两节串联]  60.2 80.01 0 top

## Footprints (pads in the part's own frame, mm; a bottom-side part is the same pattern mirrored in y, then rotated)
18650电池盒两节串联
  oval 2.54x4.572 hole 1.016x2.032: 1(-36.25,10.45) 2(36.25,10.45) 3(36.25,-10.45) 4(-36.25,-10.45)
buz-th_bd12.5-p6.50-d0.9
  round 2.286 hole 1: 1(-3.25,0) 2(3.25,0)
cap-th_bd6.3-p2.50-d1.0-fd
  round 1.778 hole 1: 1(-1.27,0) 2(1.27,0)
DIP-8_L9.7-W6.4-P2.54-LS7.6-BL
  rect 1.801x1.801 hole 1.001: 1(-3.81,-3.81)
  round 1.801 hole 1.001: 2(-1.27,-3.81) 3(1.27,-3.81) 4(3.81,-3.81) 5(3.81,3.81) 6(1.27,3.81) 7(-1.27,3.81) 8(-3.81,3.81)
do-41_bd2.4-l4.7-p8.70-d0.9-rd
  round 2.54 hole 1: 1(-4.35,0) 2(4.35,0)
do-41_bd2.4-l4.7-p8.70-d0.9-rd#2
  round 2.159 hole 1: 1(-4.35,0) 2(4.35,0)
hc-05 pcb
  rect 1.905x1.905 hole 1.016: 1(0,0)
  round 1.905 hole 1.016: 2(0,-2.54) 3(0,-5.08) 4(0,-7.62) 5(0,-10.16) 6(0,-12.7)
hc-hr04
  rect 1.778x1.778 hole 0.894x0.889: 1(-3.81,0)
  round 1.778 hole 0.894x0.889: 2(-1.27,0) 3(1.27,0) 4(3.81,0)
hdr-th_4p-p2.54-v-m
  round 2.286 hole 1.1: 1(-3.81,0) 4(3.81,0)
hdr-th_4p-p2.54-v-m#2
  round 2.413 hole 1.1: 1(-3.81,0) 4(3.81,0)
hdr-th_25p-p2.54-v-m
  rect 1.778x1.778 hole 1.049: 1(-30.48,0)
  round 1.778 hole 1.049: 2(-27.94,0) 3(-25.4,0) 4(-22.86,0) 5(-20.32,0) 6(-17.78,0) 7(-15.24,0) 8(-12.7,0) 9(-10.16,0) 10(-7.62,0) 11(-5.08,0) 12(-2.54,0) 13(0,0) 14(2.54,0) 15(5.08,0) 16(7.62,0) 17(10.16,0) 18(12.7,0) 19(15.24,0) 20(17.78,0) 21(20.32,0) 22(22.86,0) 23(25.4,0) 24(27.94,0) 25(30.48,0)
heatsink-th_l15.5-w10.5-xsd1226-005
  round 2.54 hole 1.6: 1(0,0)
key-th_4p-l6.0-w6.0-p3.90-ls6.5
  round 2.286 hole 1.199: 1(-3.248,1.95) 2(3.251,1.95) 3(-3.248,-1.95) 4(3.251,-1.95)
led-th_bd3.0-p2.54-fd
  round 1.778 hole 0.914: 1(-1.27,0) 2(1.27,0)
led-th_bd5.8-p2.54-fd
  rect 1.778x1.778 hole 1: 1(-1.27,0)
  round 1.778 hole 1: 2(1.27,0)
opto-th_itr9909
  round 1.778 hole 0.914: 1(-2.05,1.27) 2(-2.05,-1.27) 3(2.05,-1.27) 4(2.05,1.27)
res-adj-th_3p-l10.0-w10.0-p2.50-l
  round 1.778 hole 0.762: 1(-2.499,0) 2(0,0) 3(2.499,0)
res-th_bd2.3-l6.5-p10.50-d0.5
  round 1.778 hole 0.7: 1(-5.25,0) 2(5.25,0)
res-th_bd2.4-l6.3-p10.30-d0.6
  round 1.778 hole 1: 1(-5.15,0) 2(5.15,0)
res-th_bd2.4-l6.3-p10.30-d0.6#2
  round 1.905 hole 1: 1(-5.15,0) 2(5.15,0)
res-th_bd2.4-l6.3-p10.30-d0.6#3
  round 2.032 hole 1: 1(-5.15,0) 2(5.15,0)
SOP-8_L4.9-W3.9-P1.27-LS6.0-BL
  oval 0.63x1.865 smd: 1(-1.905,-2.683) 2(-0.635,-2.683) 3(0.635,-2.683) 4(1.905,-2.683) 5(1.905,2.683) 6(0.635,2.683) 7(-0.635,2.683) 8(-1.905,2.683)
stc8h8k64u_core
  round 1.778 hole 1.049: 1(-7.62,30.48) 2(-7.62,27.94) 3(-7.62,25.4) 4(-7.62,22.86) 5(-7.62,20.32) 6(-7.62,17.78) 7(-7.62,15.24) 8(-7.62,12.7) 9(-7.62,10.16) 10(-7.62,7.62) 11(-7.62,5.08) 12(-7.62,2.54) 13(-7.62,0) 14(-7.62,-2.54) 15(-7.62,-5.08) 16(-7.62,-7.62) 17(-7.62,-10.16) 18(-7.62,-12.7) 19(-7.62,-15.24) 20(-7.62,-17.78) 21(-7.62,-20.32) 22(-7.62,-22.86) 23(-7.62,-25.4) 24(-7.62,-27.94) 25(-7.62,-30.48) 26(7.62,30.48) 27(7.62,27.94) 28(7.62,25.4) 29(7.62,22.86) 30(7.62,20.32) 31(7.62,17.78) 32(7.62,15.24) 33(7.62,12.7) 34(7.62,10.16) 35(7.62,7.62) 36(7.62,5.08) 37(7.62,2.54) 38(7.62,0) 39(7.62,-2.54) 40(7.62,-5.08) 41(7.62,-7.62) 42(7.62,-10.16) 43(7.62,-12.7) 44(7.62,-15.24) 45(7.62,-17.78) 46(7.62,-20.32) 47(7.62,-22.86) 48(7.62,-25.4) 49(7.62,-27.94) 50(7.62,-30.48)
sw-th_sk-12e12-g5
  round 1.778 hole 1.001: 1(0,3.175) 2(0,0.127) 3(0,-2.921)
  round 2.286 hole 1.501: 4(0,-6.477) 5(0,6.477)
to-92-3_l5.1-w4.1-p1.27-l
  rect 0.899x1.778 hole 0.701: 1(-1.778,0)
  oval 0.899x1.778 hole 0.701: 2(0,0) 3(1.778,0)
TO-220-3_L10.0-W4.5-P2.54-L
  rect 1.801x2.601 hole 1.199: 1(-2.54,0.005)
  oval 1.801x2.601 hole 1.199: 2(0,0.005) 3(2.54,-0.005)
直流电机N20_水平装配
  round 2.1 hole 2.005x2: 1(-9,4.5) 2(9,4.5)
  round 2 hole 2.105x2.1: 3(-8.999,4.501) 4(8.999,4.501)

## Nets
As in the schematic.

Pads without a net: ASS_1 1 2 3 4; ASS_1#2 1 2 3 4; ASS_1#3 1 2 3 4; ASS_1#4 1 2 3 4; SW1 3; U14 1; U15 5 6 7

## Via types
v1: diameter 0.61, hole 0.305, Top Layer to Bottom Layer, 31 vias

## Routing (per net, layer and track width the routed paths; a pad name or vN(x,y) marks a point on that pad's centre or on a via; arc(x,y) is an arc through that point)
+5V: length 499
  Top Layer w0.635: BUZZER2.1 16.55,46.03 D2.1 ; R21.2 89.34,129.72 87.25,127.63 73.97,127.63 R22.2 ; D2.1 23.88,51.15 23.88,63.88 26.16,66.17 26.16,74.68 21.84,78.99 21.84,93.73 33.15,105.03 36.96,105.03 v1(38.99,107.06) ; D2.1 21.72,40.86 21.72,9.4 23.75,7.37 39.88,7.37 41.76,9.25 41.76,11.4 44.36,14 49.05,14 C2.1 51.84,27.91 34.06,27.91 32.26,29.72 H7.24 U1.49 39.88,43.69 99.06,43.69 v1(101.47,46.1)
  Top Layer w1.524: R22.2 R18.2 R14.2 72.19,137.31 R10.2 ; R9.2 89.24,132.31 R21.2 ; R25.2 65.45,126.85 R27.2 ; R19.2 48.3,129.51 R11.2 ; R12.2 31.16,132.31 R20.2
  Bottom Layer w0.635: R20.2 30.99,132.14 30.99,129.92 38.99,121.92 v1(38.99,107.06) 40.98,105.07 RP4.3 RP3.3 RP5.3 RP2.3 RP1.3 75.48,105.07 77.09,106.68 77.09,110.49 73.91,113.66 73.91,121.16 U12.8 76.2,125.41 R22.2 ; R19.2 51.82,125.8 U13.8 53.59,125.22 62.23,125.22 U15.8 65.35,124.78 R27.2 ; BLUETOOTH.2 103,55.37 101.85,54.23 101.85,46.48 v1(101.47,46.1) ; R25.2 68.11,137.41 R10.2 72.09,143.17 H4.4
  Bottom Layer w2.54: U4.3 57.66,22.1 C2.1
GND: length 10.2
  Top Layer w0.381: U1.50 H7.25 ; H1.25 U1.25
  vias: v1(36.83,114.3) v1(40.89,139.06) v1(43.94,125.22) v1(45.97,121.92) v1(50.33,119.63) v1(54.99,27.81) v1(56.77,129.67) v1(58.04,136.27) v1(60.83,28.96) v1(62.74,27.18) v1(70.99,122.55) v1(72.39,125.17) v1(79.38,139.22) v1(84.32,33.78) v1(86.87,33.78) v1(89.41,33.78) v1(92.2,33.4) v1(93.34,48.64) v1(93.98,12.95) v1(96.65,142.11) v1(97.79,130.94)
VCC: length 355.8
  Top Layer w0.381: R5.1 65.08,20.26 C1.1
  Bottom Layer w0.381: R3.2 112.87,43.31 102.45,43.31 99.65,40.51
  Bottom Layer w2.54: 62.74,23.97 60.92,25.78 45.97,25.78 43.2,23.01 33.04,23.01 26.54,16.51 22.86,16.51 20.8,18.57 20.8,114.78 22.99,116.97 24.89,116.97 ; 62.74,23.97 64.55,25.78 75.56,25.78 77.47,23.88 77.47,9.65 80.9,6.22 90.55,6.22 95.25,10.92 97.41,10.92 99.65,13.16 99.65,108.46 96.6,111.51 95.63,111.51 ; 62.74,23.97 U4.1 62.74,13.84 63.37,13.21 SW1.1
ADC: length 48.2
  Top Layer w0.381: R4.1 R6.2 107.26,43.31 105.15,43.31 104.36,42.52 102.58,42.52 96.86,36.8 94.87,36.8 93.47,35.41 93.47,30.61 92.08,29.21 82.3,29.21 H7.5 U1.30
BAT: length 92.3
  Top Layer w2.54: 23.95,90.29 23.95,80.19 28.57,75.56 28.57,65.28 25.91,62.61 25.91,30.04 30.17,25.78 45.72,25.78 48.51,22.99 D1.2
BT-EN: length 42.6
  Top Layer w0.381: BLUETOOTH.1 105.41,56.26 105.41,44.32 104.14,43.05 102.35,43.05 96.64,37.34 86.87,37.34 U1.28 H7.3
BT-STATE: length 29.6
  Top Layer w0.381: BLUETOOTH.6 96.42,37.87 84.86,37.87 U1.29 H7.4
BUZZER: length 59.8
  Top Layer w0.381: R1.1 7.93,65.72 10.79,68.58 20.32,68.58 v1(23.24,65.66) ; U1.47 H7.22
  Bottom Layer w0.381: U1.47 23.24,50.16 v1(23.24,65.66)
ECHO: length 107.8
  Top Layer w0.381: H4.2 58.93,150.37 59.82,149.48 61.6,149.48 65.13,145.96 65.13,139.16 62.2,136.24 62.2,63.35 55.24,56.39 H1.15 U1.15
KEY: length 65.7
  Top Layer w0.381: KEY1.2 KEY1.1 42.42,6.96 42.42,11.12 44.63,13.33 49.32,13.33 54.4,18.41 58.04,18.41 60.2,20.57 60.2,25.91 57.53,28.57 41.53,28.57 39.88,30.23 H7.21 U1.46
LED-L: length 110.2
  Top Layer w0.381: v1(38.99,124.08) 41.48,121.59 41.48,111.06 42.42,110.12 H1.20 U1.20
  Bottom Layer w0.381: R8.2 31.16,142.96 34.42,139.7 34.42,128.65 v1(38.99,124.08)
LED-R: length 109.1
  Top Layer w0.381: v1(86.87,124.71) 86.87,96.52 90.55,92.84 90.55,65.4 88.14,62.99 H1.2 U1.2
  Bottom Layer w0.381: v1(86.87,124.71) 86.87,140.72 89.28,143.13 89.28,156.8 R7.2
LH-B: length 47.9
  Top Layer w0.381: v1(26.54,11.81) 27.33,12.6 27.33,19.3 29.21,21.18 v1(29.21,23.75) ; U1.41 H7.16
  Bottom Layer w0.381: v1(26.54,11.81) U3.1 ; v1(29.21,23.75) 29.21,26.03 32.13,28.96 50.55,28.96 H7.16
LH-F: length 48.4
  Top Layer w0.381: v1(26.03,13.08) 26.8,13.84 26.8,19.65 28.45,21.3 v1(28.45,21.59) ; U1.40 H7.15
  Bottom Layer w0.381: H7.15 52.55,28.42 32.35,28.42 30.11,26.18 30.11,23.25 v1(28.45,21.59) ; v1(26.03,13.08) U3.2
LQ-B: length 89.3
  Top Layer w0.381: H1.11 U1.11
  Bottom Layer w0.381: U2.1 25.91,112.27 26.42,111.76 26.42,108.58 32.75,102.25 42.14,102.25 45.97,98.42 45.97,81.66 53.59,74.05 62.35,74.05 65.28,71.12 H1.11
LQ-F: length 91.4
  Top Layer w0.381: H1.10 U1.10
  Bottom Layer w0.381: H1.10 65.81,58.39 65.81,71.34 62.57,74.58 53.81,74.58 46.51,81.88 46.51,98.65 42.37,102.79 32.97,102.79 26.95,108.81 26.95,112.12 25.53,113.54 U2.2
MCU-RXD: length 32.4
  Top Layer w0.381: 103.76,50.29 101.75,48.29 95.48,48.29 94.36,49.4 92.33,49.4 91.21,48.29 81.75,48.29 80.52,49.52 U1.5 H1.5
MCU-TXD: length 32.3
  Top Layer w0.381: BLUETOOTH.5 81.53,47.75 U1.6 H1.6
P0.0: length 5.1
  Top Layer w0.381: U1.31 H7.6
P0.4: length 5.1
  Top Layer w0.381: U1.27 H7.2
P0.6: length 98
  Top Layer w0.381: LED5.2 80.62,139.22 80.62,133.95 R18.1 ; 76.2,120.9 78.99,118.11 78.99,111.51 85.6,104.9 H1.3 U1.3
  Bottom Layer w0.381: 76.2,120.9 80.77,125.48 80.77,130.36 R18.1
P0.7: length 5.1
  Top Layer w0.381: H1.4 U1.4
P1.3: length 102.9
  Top Layer w0.381: U1.12 H1.12 62.74,136.02 65.66,138.94 65.66,146.18 61.47,150.37 H4.3
P1.4: length 73.9
  Top Layer w0.381: H1.8 U1.8
  Bottom Layer w0.381: U5.2 94.36,114.81 93.73,114.17 93.73,109.35 72.9,88.52 H1.8
P1.5: length 76
  Top Layer w0.381: H1.9 U1.9
  Bottom Layer w0.381: U5.1 94.74,116.08 93.19,114.53 93.19,109.57 72.36,88.74 72.36,59.69 70.36,57.68 H1.9
P2.2: length 50.2
  Top Layer w0.381: U1.39 H7.14
  Bottom Layer w0.381: H7.14 60.71,27.94 84.5,27.94 95.9,16.54 U6.1
P2.3: length 51.4
  Top Layer w0.381: U1.38 H7.13
  Bottom Layer w0.381: U6.2 96.9,14.35 97.41,14.86 97.41,16 84.84,28.57 62.61,28.57 H7.13
P2.4-SDA: length 5.1
  Top Layer w0.381: U1.37 H7.12
P2.5-SCL: length 5.1
  Top Layer w0.381: U1.36 H7.11
P2.6: length 5.1
  Top Layer w0.381: U1.35 H7.10
P2.7: length 5.1
  Top Layer w0.381: U1.34 H7.9
P3.0_RXD_D-: length 5.1
  Top Layer w0.381: H1.16 U1.16
P3.1_TXD_D+: length 5.1
  Top Layer w0.381: H1.17 U1.17
P3.2: length 107.6
  Top Layer w0.381: LED6.2 40.39,137.29 40.39,131.9 R19.1 37.9,127.7 38.58,127.03 45.69,127.03 54.36,118.36 54.36,113.79 55.75,112.39 55.75,96.39 47.5,88.14 H1.18 U1.18
P3.3: length 116.1
  Top Layer w0.381: U1.19 H1.19 44.96,108.34 42.01,111.28 42.01,121.26 U13.1 42.21,125.42 31.04,125.42 24.26,132.21 R20.1
  Bottom Layer w0.381: R20.1 20.76,132.26 23.14,134.65 23.14,140.23 LED7.2
P3.5: length 5.1
  Top Layer w0.381: U1.48 H7.23
P4.1: length 5.1
  Top Layer w0.381: U1.45 H7.20
P4.2: length 5.1
  Top Layer w0.381: U1.44 H7.19
P4.3: length 5.1
  Top Layer w0.381: U1.43 H7.18
P4.4: length 5.1
  Top Layer w0.381: U1.42 H7.17
P4.5: length 5.1
  Top Layer w0.381: U1.33 H7.8
P4.6: length 5.1
  Top Layer w0.381: U1.32 H7.7
P4.7: length 124.6
  Top Layer w0.381: U1.7 H1.7 75.44,75.69 65.02,86.11 65.02,112.01 66.42,113.41 66.42,121.28 U12.1 72.01,126.87 91.44,126.87 99.57,135 R17.1
  Bottom Layer w0.381: R17.1 97.82,136.82 97.82,142.21 LED4.2
P5.0: length 100.3
  Top Layer w0.381: U15.1 55.05,124.78 R27.1 57.53,129.23 57.53,134.49 LED8.2 ; U1.21 H1.21 39.88,106.68 v1(41.27,108.08)
  Bottom Layer w0.381: v1(41.27,108.08) 46.23,113.03 51.56,113.03 54.1,115.57 54.1,121.16 U15.1
P5.1: length 5.1
  Top Layer w0.381: H1.22 U1.22
P5.2: length 5.1
  Top Layer w0.381: U1.26 H7.1
P5.3: length 5.1
  Top Layer w0.381: H1.1 U1.1
P5.4-RST: length 5.1
  Top Layer w0.381: H1.13 U1.13
VREF: length 5.1
  Top Layer w0.381: H1.14 U1.14
$1N5269: length 16.4
  Bottom Layer w2.54: D1.1 54.77,10.76 60.33,5.21 SW1.2
$1N5272: length 4.3
  Top Layer w0.381: LED2.1 102.11,154.47 R7.1
$1N5275: length 4.3
  Top Layer w0.381: R8.1 20.66,155.91 LED3.1
$1N5280: length 15.6
  Top Layer w0.381: 44.2,120.9 42.55,119.25 42.55,111.51 RP4.2
$1N5281: length 13
  Top Layer w0.381: RP3.2 52.96,107.57 51.69,108.84 51.69,111 53.34,112.65 53.34,116.84 U13.6
$1N5282: length 13
  Top Layer w0.381: U10.2 37.8,147.25 R11.1
$1N5283: length 17.5
  Top Layer w0.381: U8.2 113.28,149.1 111.63,147.45 106.72,147.45 R9.1
$1N5309: length 2.8
  Top Layer w0.381: R4.2 115.81,56.59 R3.1
$1N5335: length 5.1
  Top Layer w0.381: H1.23 U1.23
$1N5336: length 5.1
  Top Layer w0.381: H1.24 U1.24
$1N5409: length 14.7
  Bottom Layer w0.381: R21.1 97.28,134.56 97.28,140.21 LED4.1
$1N5410: length 15.7
  Bottom Layer w0.381: 68.58,120.9 72.39,117.09 72.39,108.84 73.66,107.57 RP1.2
$1N5411: length 60.2
  Top Layer w0.381: U8.4 105.43,145.4 101.14,141.11 101.14,139.3 R13.1 100.98,136.45 100.98,131.21 99.44,129.67 94.99,129.67 91.66,126.34 76.56,126.34 U12.3
$1N5412: length 15.3
  Top Layer w0.381: R10.1 82.59,138.47 88.9,144.78 88.9,147.97 U9.2
$1N5413: length 15.5
  Top Layer w0.381: U12.6 69.6,111.76 69.6,108.58 68.58,107.57 RP2.2
$1N5420: length 10.8
  Top Layer w0.381: LED6.1 39.75,139.19 39.75,133.93 R23.1
$1N5422: length 35.5
  Top Layer w0.381: U9.4 84.84,141.6 81.15,137.92 81.15,136.09 R14.1
  Bottom Layer w0.381: 76.2,115.82 83.95,123.57 83.95,133.29 R14.1
$1N5423: length 43
  Top Layer w0.381: U10.4 36.19,142.22 36.19,136.4 37.85,134.75 R15.1 37.9,134.68 36.19,132.97 36.19,128.65 38.35,126.49 45.47,126.49 49.4,122.56 49.4,118.24 51.82,115.82
$1N5424: length 16.5
  Top Layer w0.381: U11.2 11.05,148.1 11.05,145.92 13.18,143.79 18.13,143.79 20.66,141.26 R12.1
$1N5425: length 57.3
  Top Layer w0.381: U11.4 9.25,143.26 17.91,143.26 19.27,141.9 19.27,139.22 20.69,137.79 R16.1 20.76,137.74 32.54,125.96 45.25,125.96 46.99,124.22 46.99,121.16 U13.3
$1N5426: length 10.9
  Bottom Layer w0.381: LED7.1 22.61,142.24 22.61,136.85 R24.1
$1N5435: length 8.3
  Bottom Layer w2.54: H3.1 34.54,12.19 29.46,12.19
$1N5436: length 8.3
  Bottom Layer w2.54: H3.4 34.54,15.24 29.46,15.24
$1N5437: length 8.3
  Bottom Layer w2.54: H2.1 34.67,112.65 29.46,112.65
$1N5438: length 8.5
  Bottom Layer w2.54: 36.83,118.11 34.42,115.7 29.34,115.7
$1N5440: length 8.5
  Bottom Layer w2.54: 83.57,118.11 85.98,115.7 91.06,115.7
$1N5441: length 8.3
  Bottom Layer w2.54: H5.4 85.72,112.65 90.93,112.65
$1N5443: length 14
  Top Layer w0.381: BUZZER2.2 11.3,55.19 11.3,55.37 ; Q1.3 11.3,55.37 ; 11.3,55.37 13.08,53.59 17.62,53.59 D2.2
$1N5444: length 10.2
  Top Layer w0.381: Q1.2 13.08,60.07 14.35,61.34 R2.2 R1.2
$1N5446: length 8.2
  Bottom Layer w2.54: 90.8,15.24 85.85,15.24 H6.1
$1N5447: length 8.2
  Bottom Layer w2.54: 90.8,12.19 85.85,12.19 H6.4
$1N5452: length 4.9
  Top Layer w0.381: LED1.1 74.68,6.76 71.88,9.56 R5.2
$1N12611: length 19.3
  Top Layer w2.54: 96.45,90.29 96.45,70.99
$1N13005: length 14.9
  Top Layer w0.381: RP5.2 58.67,109.09 58.67,118.62 56.39,120.9
$1N13006: length 18.8
  Top Layer w0.381: U7.2 62.21,146.7 63.12,145.8 63.12,141.35 62.36,140.59 58.29,140.59 54.95,137.24 R25.1
$1N13007: length 29.8
  Top Layer w0.381: U15.3 53.47,121.28 53.47,130.5 R26.1 53.47,133.66 53.47,138.56 57.51,142.6 U7.4
$1N13008: length 10.6
  Top Layer w0.381: R28.1 56.9,131.26 56.9,136.4 LED8.1
$1N15984: length 14.5
  Top Layer w0.381: R22.1 80.09,131.82 80.09,137.21 LED5.1

## Copper pours and planes (outline as drawn; the poured copper is in the pictures)
GND on Top Layer: -41.02,216.53 159.64,216.53 159.64,-56.64 -41.02,-56.64
GND on Bottom Layer: -79.63,190.63 197.87,190.63 197.87,-25.78 -79.63,-25.78

Small or netless copper shapes (teardrops, artwork), in the pictures only: 222 on Top Layer, 68 on Bottom Layer

## Text on the board
Bottom Silkscreen Layer: 白
Top Silkscreen Layer: - | + | USB接口
